# Altium schematic sheet LaserLider.SchDoc
size A4
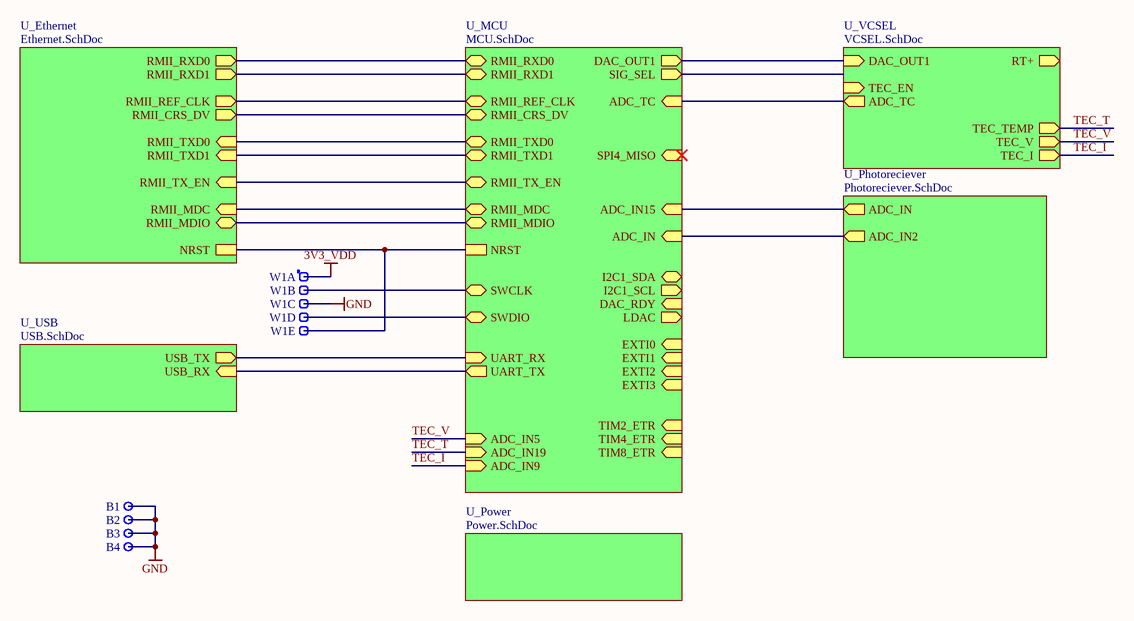
[diagram p0: LaserLider.SchDoc]

## Parts
B1  Plated Hole  [MTG300_600]  (value not drawn)  (no BOM)
B2  Plated Hole  [MTG300_600]  (value not drawn)  (no BOM)
B3  Plated Hole  [MTG300_600]  (value not drawn)  (no BOM)
B4  Plated Hole  [MTG300_600]  (value not drawn)  (no BOM)
W1  Header 5  [SAMTEC_MTLW-105-07-L-S-250]  (value not drawn)  (parts A,B,C,D,E of 5)

## Sub-sheets
U_Ethernet = Ethernet.SchDoc: RMII_TXD0 (in), RMII_TX_EN (in), RMII_RXD0 (out), RMII_REF_CLK (out), RMII_CRS_DV (out), RMII_MDC (in), RMII_MDIO (bidir), NRST, RMII_TXD1 (in), RMII_RXD1 (out)
U_MCU = MCU.SchDoc: SWCLK (bidir), RMII_RXD0 (bidir), RMII_REF_CLK (bidir), RMII_CRS_DV (bidir), RMII_MDC (bidir), RMII_MDIO (bidir), RMII_RXD1 (bidir), SWDIO (bidir), RMII_TXD0 (bidir), RMII_TX_EN (bidir), RMII_TXD1 (bidir), NRST, DAC_OUT1 (out), UART_TX (out), UART_RX (in), ADC_IN (in), ADC_TC (in), SIG_SEL (out), EXTI3 (in), I2C1_SCL (out), I2C1_SDA (bidir), DAC_RDY (in), EXTI1 (in), SPI4_MISO (in), LDAC (out), EXTI2 (in), EXTI0 (in), TIM8_ETR (in), TIM4_ETR (in), TIM2_ETR (in), ADC_IN15 (in), ADC_IN5 (in), ADC_IN19 (in), ADC_IN9 (in)
U_Photoreciever = Photoreciever.SchDoc: ADC_IN (out), ADC_IN2 (out)
U_Power = Power.SchDoc: no entries
U_USB = USB.SchDoc: USB_TX (out), USB_RX (in)
U_VCSEL = VCSEL.SchDoc: DAC_OUT1 (in), ADC_TC (out), RT+ (out), TEC_I (out), TEC_TEMP (out), TEC_V (out), TEC_EN (in)

## Nets
3V3_VDD: W1.1
GND: B1.1 B2.1 B3.1 B4.1 W1.3
TEC_I: sheet U_MCU/ADC_IN9, sheet U_VCSEL/TEC_I
TEC_T: sheet U_MCU/ADC_IN19, sheet U_VCSEL/TEC_TEMP
TEC_V: sheet U_MCU/ADC_IN5, sheet U_VCSEL/TEC_V
NetW1_2: W1.2 ; sheet U_MCU/SWCLK
NetW1_4: W1.4 ; sheet U_MCU/SWDIO
NetW1_5: W1.5 ; sheet U_MCU/NRST, sheet U_Ethernet/NRST
(unnamed): sheet U_MCU/RMII_RXD0, sheet U_Ethernet/RMII_RXD0
(unnamed): sheet U_MCU/RMII_REF_CLK, sheet U_Ethernet/RMII_REF_CLK
(unnamed): sheet U_MCU/RMII_CRS_DV, sheet U_Ethernet/RMII_CRS_DV
(unnamed): sheet U_MCU/RMII_MDC, sheet U_Ethernet/RMII_MDC
(unnamed): sheet U_MCU/RMII_MDIO, sheet U_Ethernet/RMII_MDIO
(unnamed): sheet U_MCU/RMII_RXD1, sheet U_Ethernet/RMII_RXD1
(unnamed): sheet U_MCU/RMII_TXD0, sheet U_Ethernet/RMII_TXD0
(unnamed): sheet U_MCU/RMII_TX_EN, sheet U_Ethernet/RMII_TX_EN
(unnamed): sheet U_MCU/RMII_TXD1, sheet U_Ethernet/RMII_TXD1
(unnamed): sheet U_MCU/DAC_OUT1, sheet U_VCSEL/DAC_OUT1
(unnamed): sheet U_MCU/UART_TX, sheet U_USB/USB_RX
(unnamed): sheet U_MCU/UART_RX, sheet U_USB/USB_TX
(unnamed): sheet U_MCU/ADC_IN, sheet U_Photoreciever/ADC_IN2
(unnamed): sheet U_MCU/ADC_TC, sheet U_VCSEL/ADC_TC
(unnamed): sheet U_MCU/ADC_IN15, sheet U_Photoreciever/ADC_IN

## Library data of the parts
B1-B4 = PLATED_HOLE3.0_PAD6.0: Single Terminal Socket; Part Description: Plated Through Hole: Hole Dia.=3.0mm Pad Dia.=6.0mm; Mounted: No; Part Number: PLATED_HOLE3.0_PAD6.0; Component Type: Standard (No BOM); Pin Count: 1; Family: Plated Hole; Socket: No; SMD: No; Sense: No; Status: None; ComponentHeight: 0mm; HelpURL: Undefined; Author: CERN DEM JLC; CreateDate: 26.05.2008; LatestRevisionDate: 26.05.2008; PackageDescription: Plated Through Hole: Hole Dia.=3.0mm Pad Dia.=6.0mm
W1 = SAMTEC_MTLW-105-07-L-S-250: 5 Mini Wire-Wrap Contact Strip Header; Part Description: 5 Contacts, Pitch 2.54mm, Single Row Through Mount Straight Header (Post Lead = 6.35mm, Tail Lead 3.05mm, Insulator 1.52mm); Manufacturer: SAMTEC; PressFit: No; Part Number: SAMTEC_MTLW-105-07-L-S-250; Component Kind: Standard; Component Type: Standard; Pin Count: 5; Family: Header 5; Mounted: Yes; Socket: No; SMD: No; Sense: No; Status: None; Manufacturer Part Number: MTLW-105-07-L-S-250; ComponentHeight: 7.87mm; HelpURL: \\cern.ch\dfs\Applications\Altium\Datasheets\SAMTEC_MTLW-105-07-L-S-250.pdf; Author: CERN DEM JLC; CreateDate: 07.01.2015; LatestRevisionDate: 07.01.2015